# EAGLE design uSD_extender_male (EAGLE 6.6.0)
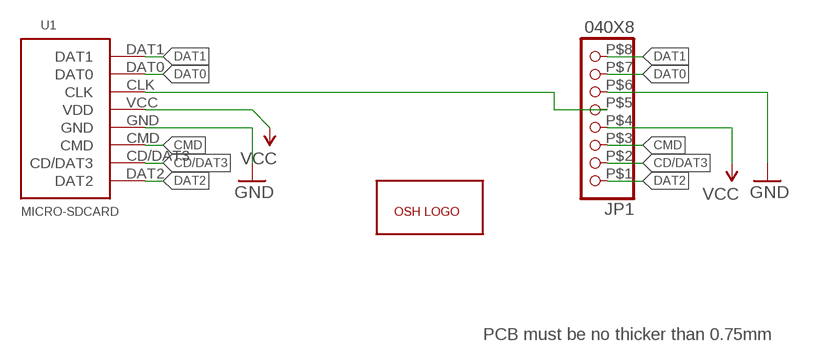
[diagram p0: schematic, sheet 1]

## Parts
JP1  040X8  [040X8]
U1  MICRO-SDCARD  [MICRO-SDCARD]
U$1  OSH_LOGO  [OSH_LOGO]

## Nets
CD/DAT3: JP1.P$2 U1.CD/DAT3
CMD: JP1.P$3 U1.CMD
DAT0: JP1.P$7 U1.DAT0
DAT1: JP1.P$8 U1.DAT1
DAT2: JP1.P$1 U1.DAT2
GND: JP1.P$6 U1.GND
N$1: JP1.P$5 U1.CLK
VCC: JP1.P$4 U1.VCC(VDD)

## Notes on the sheet
- PCB must be no thicker than 0.75mm

## Library data of the parts
JP1 = Dean:040X8
U1 = SparkFun-Boards:MICRO-SDCARD: MicroSD footprint- NOT a socket for a MicroSD card!
U$1 = Dean:OSH_LOGO

## Board
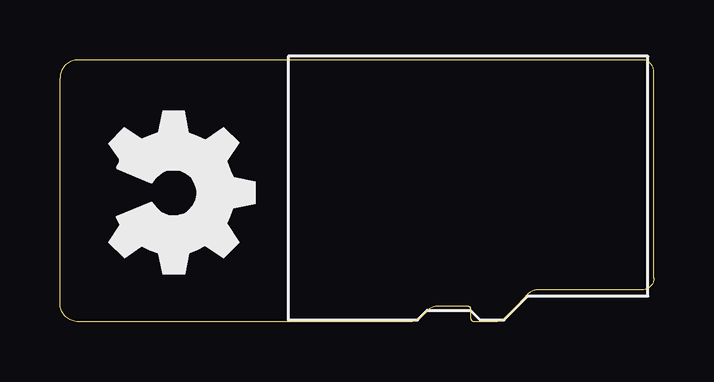
[diagram p1: board, top side]
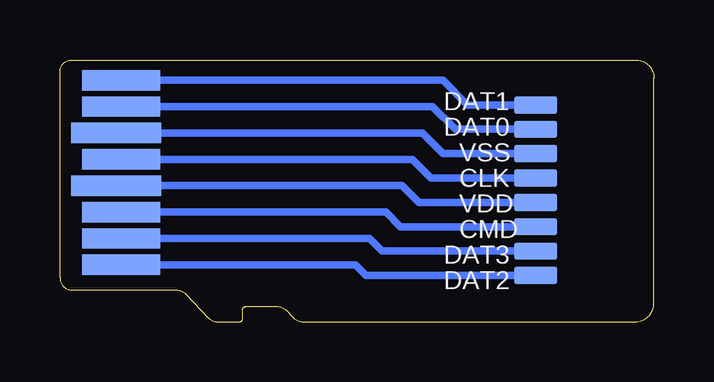
[diagram p2: board, bottom side, seen from below]

Size 24.77 x 10.92 mm. Coordinates in mm from the lower left corner, seen from the top.
Outline: 24.26,10.92 0.76,10.92 arc90 0,10.16 0,0.76 arc90 0.76,0 14.65,0 arc45 15.01,0.15 15.35,0.49 arc-45 15.7,0.64 17.02,0.64 arc-90 17.14,0.51 17.14,0.13 arc90 17.27,0 18.2,0 arc45 18.56,0.15 19.54,1.17 arc-45 19.89,1.32 24.26,1.32 arc90 24.77,1.83 24.77,10.41 arc90 24.26,10.92
Copper layers (1*16): Top 0.035mm / dielectric 1.5mm / Bottom 0.035mm
Design rules "SparkFun-2-layer *": minimum track width 7mil, minimum drill 15mil, track to track 8mil, track to pad 8mil, pad to pad 8mil, via to via 8mil, smd to smd 8mil, copper to edge 8mil, drill to drill 8mil, minimum pad ring 12mil, minimum via ring 10mil, stop-mask expansion 2mil, vias tented up to drill 20mil, thermal gap 10mil

### Footprints (pad centres in the part's own frame; a part is rotated, then mirrored left to right if it is on the bottom)
040X8 = smd 0.711 x 1.778: P$1 0,0; P$2 1.016,0; P$3 2.032,0; P$4 3.048,0; P$5 4.064,0; P$6 5.08,0; P$7 6.096,0; P$8 7.112,0
MICRO-SDCARD = smd 0.85 x 3.25 bottom: CD/DAT3 2.56,2.3; CLK 5.86,2.3; CMD 3.66,2.3; DAT0 8.06,2.3; DAT1 9.16,2.3; DAT2 1.46,2.3 | smd 0.85 x 3.75 bottom: GND 6.96,2.1; VCC 4.76,2.1

### Placement (x,y rotation side)
JP1  4.93,1.93 90 bottom
U1  24.51,0.91 90 top
U$1  1.91,8.89 270 top

### Tracks (layer width: path | path; a pad name or v marks a point on that pad's centre or on a via)
CD/DAT3
  Bottom 0.305: U1.CD/DAT3 11.86,3.47 11.33,2.95 JP1.P$2
CMD
  Bottom 0.305: U1.CMD 11.18,4.57 10.57,3.96 JP1.P$3
DAT0
  Bottom 0.305: U1.DAT0 9.23,8.97 8.28,8.03 JP1.P$7
DAT1
  Bottom 0.305: U1.DAT1 8.8,10.07 7.77,9.04 JP1.P$8
DAT2
  Bottom 0.305: U1.DAT2 12.45,2.37 12,1.93 JP1.P$1
GND
  Bottom 0.305: JP1.P$6 8.79,7.01 9.65,7.87 U1.GND
N$1
  Bottom 0.305: JP1.P$5 9.3,5.99 10.08,6.77 U1.CLK
VCC
  Bottom 0.305: U1.VCC 10.5,5.67 9.8,4.98 JP1.P$4

### Text on the board
bNames: DAT1 | DAT0 | VSS | CLK | VDD | CMD | DAT3 | DAT2